# EAGLE design xmegaboard (EAGLE 6.1)
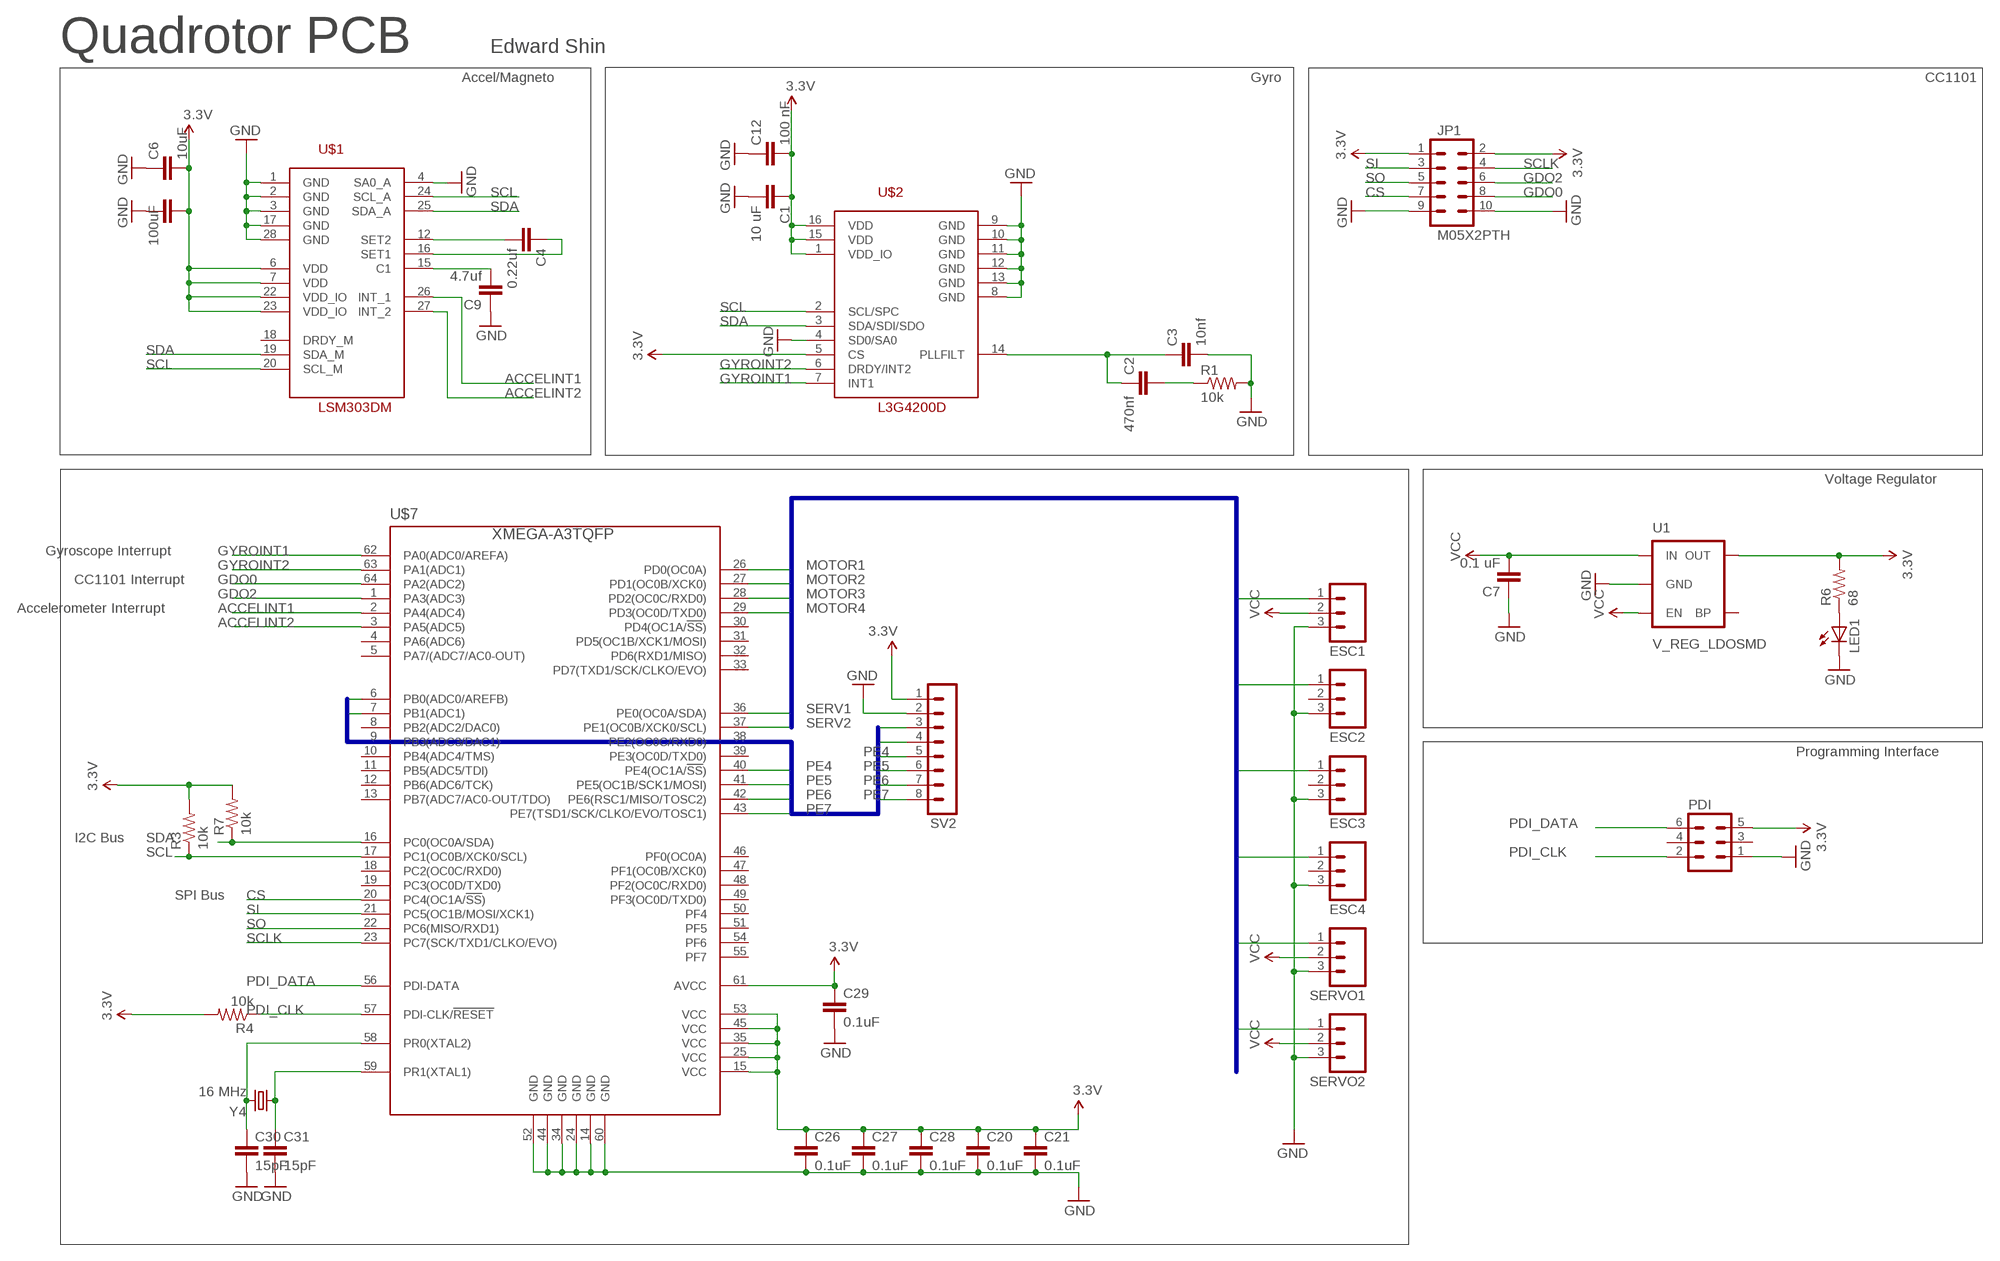
[diagram p0: schematic, sheet 1]

## Parts
C1  10 uF  CAP0603-CAP  [0603-CAP]
C2  470nf  CAP0603-CAP  [0603-CAP]
C3  10nf  CAP0603-CAP  [0603-CAP]
C4  0.22uf  CAP0603-CAP  [0603-CAP]
C5  100uF  CAP0603-CAP  [0603-CAP]
C6  10uF  CAP0603-CAP  [0603-CAP]
C7  0.1 uF  CAP0603-CAP  [0603-CAP]
C9  4.7uf  CAP0603-CAP  [0603-CAP]
C12  100 nF  CAP0603-CAP  [0603-CAP]
C20  0.1uF  CAP0603-CAP  [0603-CAP]
C21  0.1uF  CAP0603-CAP  [0603-CAP]
C26  0.1uF  CAP0603-CAP  [0603-CAP]
C27  0.1uF  CAP0603-CAP  [0603-CAP]
C28  0.1uF  CAP0603-CAP  [0603-CAP]
C29  0.1uF  CAP0603-CAP  [0603-CAP]
C30  15pF  CAP0603-CAP  [0603-CAP]
C31  15pF  CAP0603-CAP  [0603-CAP]
ESC1  M03PTH  [1X03]
ESC2  M03PTH  [1X03]
ESC3  M03PTH  [1X03]
ESC4  M03PTH  [1X03]
JP1  M05X2PTH  [AVR_ICSP]
LED1  LED0603  [LED-0603]
PDI  MA03-2  [MA03-2]
R1  10k  RESISTOR0603-RES  [0603-RES]
R3  10k  RESISTOR0603-RES  [0603-RES]
R4  10k  RESISTOR0603-RES  [0603-RES]
R6  68  RESISTOR0603-RES  [0603-RES]
R7  10k  RESISTOR0603-RES  [0603-RES]
SERVO1  M03PTH  [1X03]
SERVO2  M03PTH  [1X03]
SV2  MA08-1  [MA08-1]
U1  V_REG_LDOSMD  [SOT23-5]
U$1  LSM303DM  [LGA28-5X5]
U$2  L3G4200D  [LGA16-4X4]
U$7  XMEGA-A3TQFP  [TQFP64]
Y4  16 MHz  CRYSTAL32-SMD  [CRYSTAL-32KHZ-SMD]

## Nets
3.3V: C1.1 C5.2 C6.2 C12.2 C20.1 C21.1 C26.1 C27.1 C28.1 C29.1 JP1.1 JP1.2 PDI.5 R3.2 R4.2 R6.2 R7.2 SV2.1 U1.5(OUT) U$1.6(VDD) U$1.7(VDD) U$1.22(VDD_IO) U$1.23(VDD_IO) U$2.1(VDD_IO) U$2.5(CS) U$2.15(VDD) U$2.16(VDD) U$7.15(VCC) U$7.25(VCC) U$7.35(VCC) U$7.45(VCC) U$7.53(VCC) U$7.61(AVCC)
ACCELINT1: U$1.26(INT_1) U$7.2(PA4(ADC4))
ACCELINT2: U$1.27(INT_2) U$7.3(PA5(ADC5))
CS: JP1.7 U$7.20(PC4(OC1A/!SS!))
GDO0: JP1.8 U$7.64(PA2(ADC2))
GDO2: JP1.6 U$7.1(PA3(ADC3))
GND: C1.2 C3.2 C5.1 C6.1 C7.1 C9.1 C12.1 C20.2 C21.2 C26.2 C27.2 C28.2 C29.2 C30.2 C31.2 ESC1.3 ESC2.3 ESC3.3 ESC4.3 JP1.9 JP1.10 LED1.C PDI.1 R1.2 SERVO1.3 SERVO2.3 SV2.2 U1.2(GND) U$1.1(GND) U$1.2(GND) U$1.3(GND) U$1.4(SA0_A) U$1.17(GND) U$1.28(GND) U$2.4(SD0/SA0) U$2.8(GND) U$2.9(GND) U$2.10(GND) U$2.11(GND) U$2.12(GND) U$2.13(GND) U$7.14(GND) U$7.24(GND) U$7.34(GND) U$7.44(GND) U$7.52(GND) U$7.60(GND)
GYROINT1: U$2.7(INT1) U$7.62(PA0(ADC0/AREFA))
GYROINT2: U$2.6(DRDY/INT2) U$7.63(PA1(ADC1))
MOTOR1: ESC1.1 U$7.26(PD0(OC0A))
MOTOR2: ESC2.1 U$7.27(PD1(OC0B/XCK0))
MOTOR3: ESC3.1 U$7.28(PD2(OC0C/RXD0))
MOTOR4: ESC4.1 U$7.29(PD3(OC0D/TXD0))
N$1: C2.1 C3.1 U$2.14(PLLFILT)
N$2: C2.2 R1.1
N$3: C4.2 U$1.12(SET2)
N$4: C4.1 U$1.16(SET1)
N$5: C9.2 U$1.15(C1)
N$11: LED1.A R6.1
N$21: C30.1 U$7.58(PR0(XTAL2)) Y4.X2
N$24: C31.1 U$7.59(PR1(XTAL1)) Y4.X1
PDI_CLK: PDI.2 R4.1 U$7.57(PDI-CLK/!RESET)
PDI_DATA: PDI.6 U$7.56(PDI-DATA)
PE2: SV2.3 U$7.6(PB0(ADC0/AREFB))
PE3: SV2.4 U$7.7(PB1(ADC1))
PE4: SV2.5 U$7.40(PE4(OC1A/!SS!))
PE5: SV2.6 U$7.41(PE5(OC1B/SCK1/MOSI))
PE6: SV2.7 U$7.42(PE6(RSC1/MISO/TOSC2))
PE7: SV2.8 U$7.43(PE7(TSD1/SCK/CLKO/EVO/TOSC1))
SCL: R3.1 U$1.20(SCL_M) U$1.24(SCL_A) U$2.2(SCL/SPC) U$7.17(PC1(OC0B/XCK0/SCL))
SCLK: JP1.4 U$7.23(PC7(SCK/TXD1/CLKO/EVO))
SDA: R7.1 U$1.19(SDA_M) U$1.25(SDA_A) U$2.3(SDA/SDI/SDO) U$7.16(PC0(OC0A/SDA))
SERV1: SERVO1.1 U$7.36(PE0(OC0A/SDA))
SERV2: SERVO2.1 U$7.37(PE1(OC0B/XCK0/SCL))
SI: JP1.3 U$7.21(PC5(OC1B/MOSI/XCK1))
SO: JP1.5 U$7.22(PC6(MISO/RXD1))
VCC: C7.2 ESC1.2 SERVO1.2 SERVO2.2 U1.1(IN) U1.3(EN)
Unconnected: ESC2.2 ESC3.2 ESC4.2 PDI.3 PDI.4 U1.4(BP) U$1.18(DRDY_M) U$7.4(PA6(ADC6)) U$7.5(PA7/(ADC7/AC0-OUT)) U$7.8(PB2(ADC2/DAC0)) U$7.9(PB3(ADC3/DAC1)) U$7.10(PB4(ADC4/TMS)) U$7.11(PB5(ADC5/TDI)) U$7.12(PB6(ADC6/TCK)) U$7.13(PB7(ADC7/AC0-OUT/TDO)) U$7.18(PC2(OC0C/RXD0)) U$7.19(PC3(OC0D/TXD0)) U$7.30(PD4(OC1A/!SS!)) U$7.31(PD5(OC1B/XCK1/MOSI)) U$7.32(PD6(RXD1/MISO)) U$7.33(PD7(TXD1/SCK/CLKO/EVO)) U$7.38(PE2(OC0C/RXD0)) U$7.39(PE3(OC0D/TXD0)) U$7.46(PF0(OC0A)) U$7.47(PF1(OC0B/XCK0)) U$7.48(PF2(OC0C/RXD0)) U$7.49(PF3(OC0D/TXD0)) U$7.50(PF4) U$7.51(PF5) U$7.54(PF6) U$7.55(PF7)

## Buses
MOTOR[1..4],SERV[1..2]
PE[2..7]

## Notes on the sheet
- Quadrotor PCB | Edward Shin
- Accel/Magneto | Gyro | CC1101
- Voltage Regulator
- Gyroscope Interrupt
- CC1101 Interrupt
- Accelerometer Interrupt
- Programming Interface
- I2C Bus
- SPI Bus

## Library data of the parts
C1-C7 C9 C12 C20 C21 C26-C31 = SparkFun:CAP: Capacitor Standard 0603 ceramic capacitor, and 0.1" leaded capacitor.
ESC1-ESC4 SERVO1 SERVO2 = SparkFun:M03: Header 3 Standard 3-pin 0.1" header. Use with straight break away headers (SKU : PRT-00116), right angle break away headers (PRT-00553), swiss pins (PRT-00743), machine pins (PRT-00117), and female headers (PRT-00115). Molex polarized connector foot print use with SKU : PRT-08232 with associated crimp pins and housings.
JP1 = SparkFun:M05X2: Header 5x2 Standard 10-pin dual row 0.1" header. Commonly used with AVR-ISP. Use with Spark Fun Electronics SKU: PRT-00778
LED1 = SparkFun:LED: LEDs Standard schematic elements and footprints for 5mm, 3mm, 1206, and 0603 sized LEDs. 5mm - Spark Fun Electronics SKU : COM-00529 (and others)
PDI = con-lstb:MA03-2: PIN HEADER; OC_FARNELL: unknown; OC_NEWARK: unknown
R1 R3 R4 R6 R7 = SparkFun:RESISTOR: Resistor Basic schematic elements and footprints for 0603, 1206, and PTH resistors.
SV2 = con-lstb:MA08-1: PIN HEADER; OC_FARNELL: unknown; OC_NEWARK: unknown
U1 = SparkFun:V_REG_LDO: Voltage Regulator LDO Standard 150mA LDO voltage regulator in SOT-23 layout. Micrel part MIC5205. BP (by-pass) pin is used to lower output noise with 470pF cap.
U$1 = st-microelectronics:LSM303DM
U$2 = st-microelectronics:L3G4200D
U$7 = avr-7:XMEGA-A3: Atmel XMega A3 series processor
Y4 = SparkFun:CRYSTAL: Crystals Various standard crystals. Proven footprints. Spark Fun Electronics SKU : COM-00534

## Board
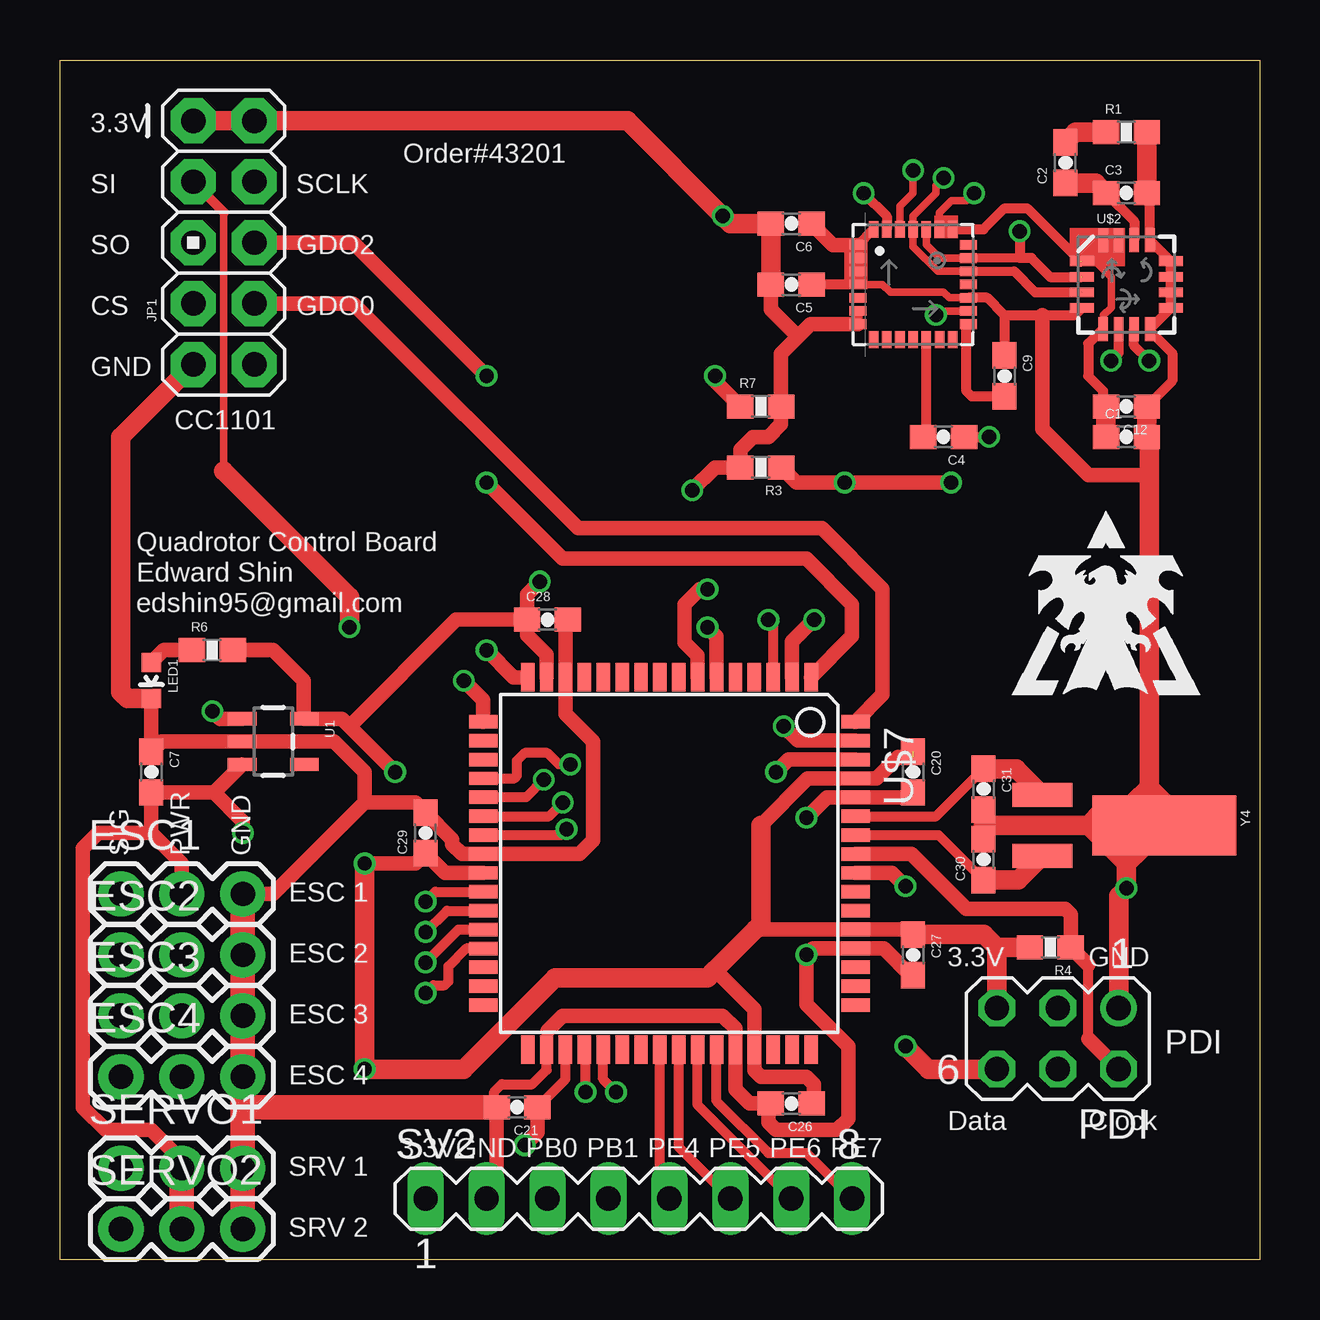
[diagram p1: board, top side]
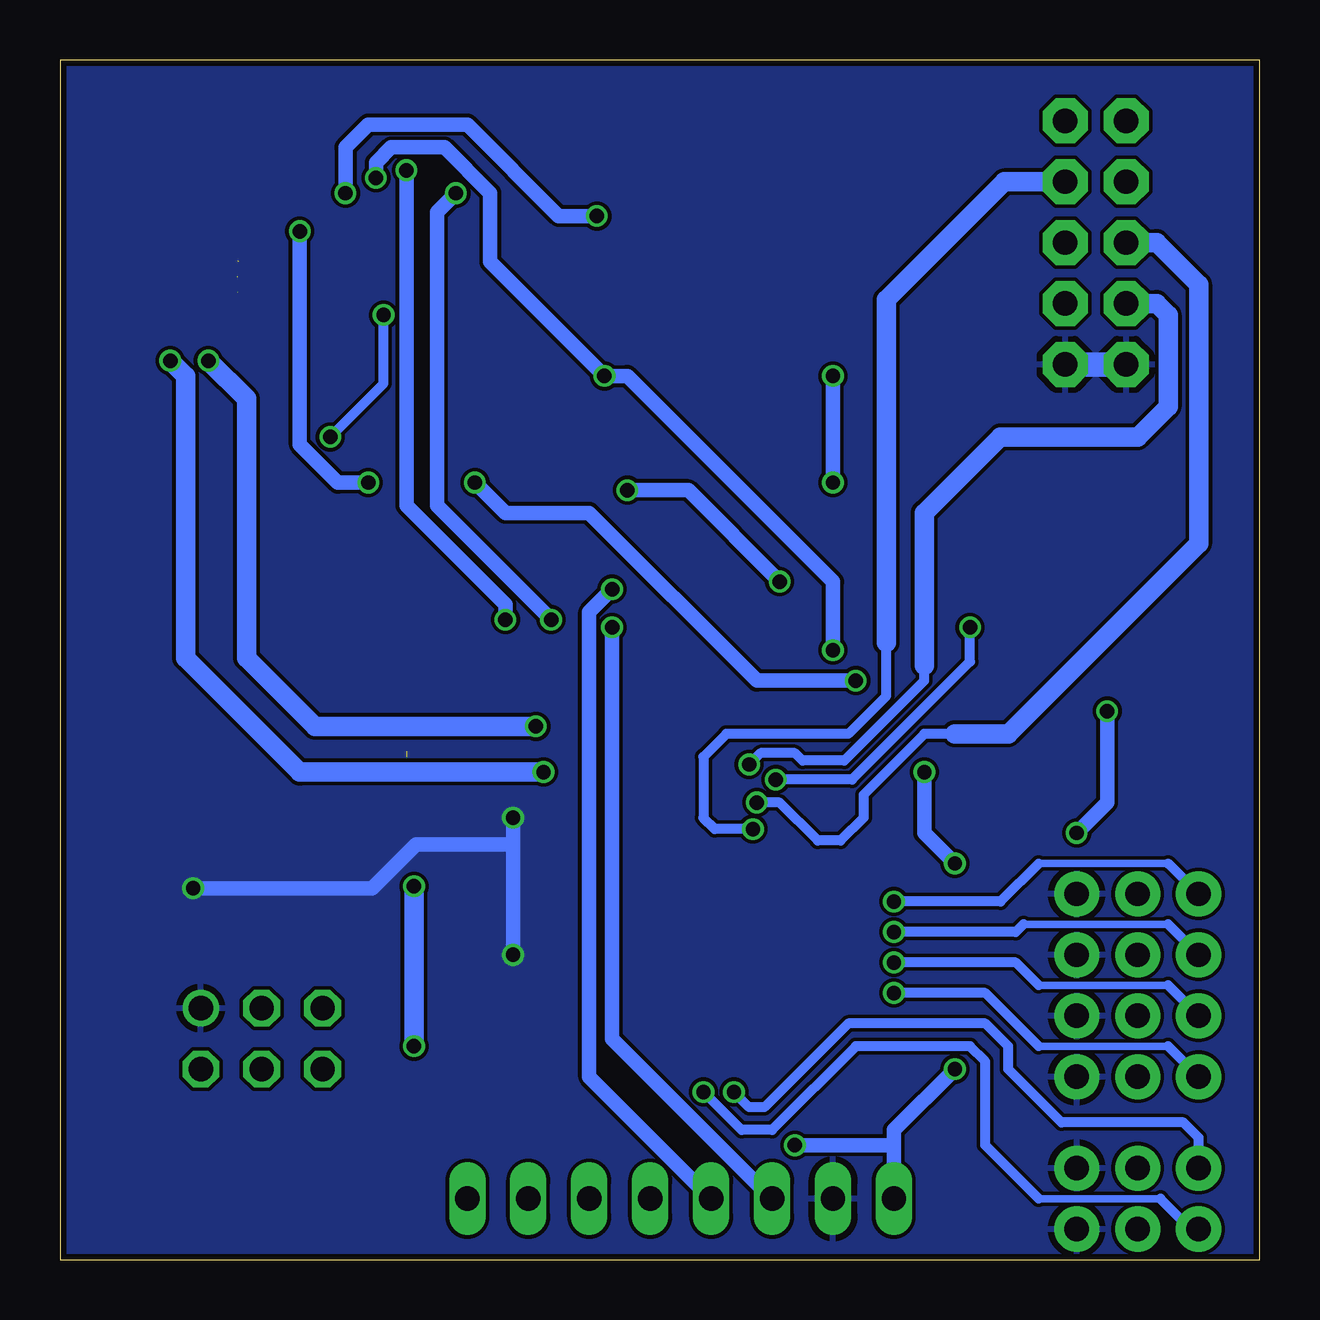
[diagram p2: board, bottom side, seen from below]

Size 50 x 50 mm. Coordinates in mm from the lower left corner, seen from the top.
Outline: 0,0 0,50 50,50 50,0 0,0
Copper layers (1*16): Top 0.035mm / dielectric 1.5mm / Bottom 0.035mm
Design rules: minimum track width 6mil, minimum drill 12mil, track to track 6mil, track to pad 6mil, pad to pad 6mil, via to via 6mil, smd to smd 0mil, copper to edge 10mil, drill to drill 10mil, minimum pad ring 10mil, minimum via ring 6mil, stop-mask expansion 2mil, vias tented up to drill 100mil, thermal gap 10mil

### Footprints (pad centres in the part's own frame; a part is rotated, then mirrored left to right if it is on the bottom)
0603-CAP = smd 1.1 x 1: 1 -0.85,0; 2 0.85,0
1X03 = drill 1.016 pad 1.88: 1 0,0; 2 2.54,0; 3 5.08,0
AVR_ICSP = drill 1.016 pad 1.88 octagon: 1 -1.27,5.08; 2 1.27,5.08; 3 -1.27,2.54; 4 1.27,2.54; 5 -1.27,0; 6 1.27,0; 7 -1.27,-2.54; 8 1.27,-2.54; 9 -1.27,-5.08; 10 1.27,-5.08
LED-0603 = smd 0.8 x 0.8: A 0,-0.75; C 0,0.75
MA03-2 = drill 1.016: 1 -2.54,-1.27 | drill 1.016 octagon: 2 -2.54,1.27; 3 0,-1.27; 4 0,1.27; 5 2.54,-1.27; 6 2.54,1.27
0603-RES = smd 1.1 x 1: 1 -0.85,0; 2 0.85,0
MA08-1 = drill 1.016 long: 1 -8.89,0; 2 -6.35,0; 3 -3.81,0; 4 -1.27,0; 5 1.27,0; 6 3.81,0; 7 6.35,0; 8 8.89,0
SOT23-5 = smd 0.55 x 1.2: 1 -0.95,-1.3; 2 0,-1.3; 3 0.95,-1.3; 4 0.95,1.3; 5 -0.95,1.3
LGA28-5X5 = smd 0.7 x 0.4: 1 -2.3,1.65; 2 -2.3,1.1; 3 -2.3,0.55; 4 -2.3,0; 5 -2.3,-0.55; 6 -2.3,-1.1; 7 -2.3,-1.65; 15 2.3,-1.65; 16 2.3,-1.1; 17 2.3,-0.55; 18 2.3,0; 19 2.3,0.55; 20 2.3,1.1; 21 2.3,1.65 | smd 0.4 x 0.7: 8 -1.65,-2.3; 9 -1.1,-2.3; 10 -0.55,-2.3; 11 0,-2.3; 12 0.55,-2.3; 13 1.1,-2.3; 14 1.65,-2.3; 22 1.65,2.3; 23 1.1,2.3; 24 0.55,2.3; 25 0,2.3; 26 -0.55,2.3; 27 -1.1,2.3; 28 -1.65,2.3
LGA16-4X4 = smd 1 x 0.4: 1 -1.85,0.975; 2 -1.85,0.325; 3 -1.85,-0.325; 4 -1.85,-0.975; 9 1.85,-0.975; 10 1.85,-0.325; 11 1.85,0.325; 12 1.85,0.975 | smd 0.4 x 1: 5 -0.975,-1.85; 6 -0.325,-1.85; 7 0.325,-1.85; 8 0.975,-1.85; 13 0.975,1.85; 14 0.325,1.85; 15 -0.325,1.85; 16 -0.975,1.85
TQFP64 = smd 1.194 x 0.559: 1 -7.76,5.905; 2 -7.76,5.118; 3 -7.76,4.331; 4 -7.76,3.543; 5 -7.76,2.756; 6 -7.76,1.968; 7 -7.76,1.181; 8 -7.76,0.394; 9 -7.76,-0.394; 10 -7.76,-1.181; 11 -7.76,-1.968; 12 -7.76,-2.756; 13 -7.76,-3.543; 14 -7.76,-4.331; 15 -7.76,-5.118; 16 -7.76,-5.905; 33 7.76,-5.905; 34 7.76,-5.118; 35 7.76,-4.331; 36 7.76,-3.543; 37 7.76,-2.756; 38 7.76,-1.968; 39 7.76,-1.181; 40 7.76,-0.394; 41 7.76,0.394; 42 7.76,1.181; 43 7.76,1.968; 44 7.76,2.756; 45 7.76,3.543; 46 7.76,4.331; 47 7.76,5.118; 48 7.76,5.905 | smd 0.559 x 1.194: 17 -5.905,-7.76; 18 -5.118,-7.76; 19 -4.331,-7.76; 20 -3.543,-7.76; 21 -2.756,-7.76; 22 -1.968,-7.76; 23 -1.181,-7.76; 24 -0.394,-7.76; 25 0.394,-7.76; 26 1.181,-7.76; 27 1.968,-7.76; 28 2.756,-7.76; 29 3.543,-7.76; 30 4.331,-7.76; 31 5.118,-7.76; 32 5.905,-7.76; 49 5.905,7.76; 50 5.118,7.76; 51 4.331,7.76; 52 3.543,7.76; 53 2.756,7.76; 54 1.968,7.76; 55 1.181,7.76; 56 0.394,7.76; 57 -0.394,7.76; 58 -1.181,7.76; 59 -1.968,7.76; 60 -2.756,7.76; 61 -3.543,7.76; 62 -4.331,7.76; 63 -5.118,7.76; 64 -5.905,7.76
CRYSTAL-32KHZ-SMD = smd 2.5 x 6: SHEILD 0,5.08 | smd 1 x 2.5: X1 -1.27,0; X2 1.27,0

### Placement (x,y rotation side)
C1  44.45,34.29 0 top
C2  41.91,45.72 90 top
C3  44.45,44.45 0 top
C4  36.83,34.29 180 top
C5  30.48,40.64 180 top
C6  30.48,43.18 180 top
C7  3.81,20.32 270 top
C9  39.37,36.83 270 top
C12  44.45,35.56 180 top
C20  35.56,20.32 270 top
C21  19.05,6.35 180 top
C26  30.48,6.51 180 top
C27  35.56,12.7 270 top
C28  20.32,26.67 0 top
C29  15.24,17.78 90 top
C30  38.5,16.67 90 top
C31  38.5,19.61 270 top
ESC1  2.54,15.24 0 top
ESC2  2.54,12.7 0 top
ESC3  2.54,10.16 0 top
ESC4  2.54,7.62 0 top
JP1  6.83,42.39 0 top
LED1  3.81,24.13 180 top
PDI  41.59,9.21 180 top
R1  44.45,46.99 0 top
R3  29.21,33.02 180 top
R4  41.28,13.02 180 top
R6  6.35,25.4 0 top
R7  29.21,35.56 0 top
SERVO1  2.54,3.81 0 top
SERVO2  2.54,1.27 0 top
SV2  24.13,2.54 0 top
U1  8.89,21.59 270 top
U$1  35.56,40.64 0 top
U$2  44.45,40.64 0 top
U$7  25.4,16.51 270 top
Y4  40.96,18.1 270 top

### Tracks (layer width: path | path; a pad name or v marks a point on that pad's centre or on a via)
3.3V  (via drill 0.6)  (2 unrouted)
  Top 0.305: U$2.1 43.16,41.62 43.82,40.96 43.82,39.69 43.5,39.37 43.5,38.81 U$2.5 | U$1.23 36.66,43.65 37.15,44.13 37.78,44.13 v38.1,44.45
  Top 0.406: U$7.35 21.07,7.52 C21.1 | 35.36,13.75 C27.1 | 28.99,13.75 29.21,13.97 | C12.2 43.47,35.69 43.47,36.22 42.86,36.83 42.86,38.18 U$2.5 | U$2.1 U$2.16 U$2.15 | U$1.23 U$1.22 38.5,42.94 39.37,43.82 40.32,43.82 42.54,41.59 | U$1.7 U$1.6
  Top 0.61: R6.2 8.89,25.4 10.16,24.13 10.16,22.57 U1.5 11.75,22.54 12.07,22.23 | v13.97,20.32 12.07,22.23 | v12.7,16.51 14.82,16.51 C29.1 16.05,16.12 U$7.25 | C21.1 19.9,5.3 v19.37,4.76 | 35.36,13.75 U$7.53 28.99,13.75 | 29.21,18.1 31.17,20.05 U$7.61 34.02,20.05 34.93,20.96 35.56,20.96 | U$1.7 31.28,38.99 30.75,38.46 | R7.2 30.06,37.77 30.75,38.46 | C28.1 16.51,26.67 12.07,22.23 | C28.1 19.47,26.04 20.28,25.22 U$7.15 | v26.35,32.07 27.31,33.02 R3.2 28.36,33.76 28.89,34.29 29.53,34.29 30.06,34.82 R7.2 | v20,28.26 19.47,27.73 C28.1 | 30.06,35.46 R7.2 | 27.31,12.07 28.94,10.43 U$7.45 28.94,7.89 29.21,7.62 31.11,7.62 31.43,7.3 31.43,6.77 C26.1 | C5.2 29.63,39.59 30.75,38.46
  Top 0.813: v12.7,16.51 v12.7,7.94 16.83,7.94 20.64,11.75 26.99,11.75 27.31,12.07 28.99,13.75 | 29.21,13.97 29.21,18.1 | C5.2 C6.2 27.94,43.18 v27.62,43.5 23.65,47.47 JP1.2 JP1.1 | C12.2 C1.1 | C27.1 38.52,13.55 39.05,13.02 | 39.05,13.02 PDI.5 | R4.2 39.05,13.02
  Bottom 0.61: v13.97,20.32 13.97,17.78 v12.7,16.51 | 15.24,4.76 15.24,5.4 v12.7,7.94 | 15.24,4.76 v19.37,4.76 | SV2.1 15.24,4.76 | v20,28.26 23.81,32.07 v26.35,32.07 | v27.62,43.5 29.21,43.5 33.02,47.31 37.15,47.31 38.1,46.36 v38.1,44.45
ACCELINT1  (via drill 0.6)
  Top 0.305: U$1.26 35.01,43.9 35.56,44.45 v35.56,45.4
  Top 0.61: U$7.2 30.52,25.76 v31.43,26.67
  Bottom 0.61: v35.56,45.4 35.56,31.43 31.43,27.31 v31.43,26.67
ACCELINT2  (via drill 0.6)
  Top 0.406: U$7.3 29.73,26.47 v29.53,26.67 | U$1.27 34.46,43.49 v33.5,44.45
  Bottom 0.61: v29.53,26.67 34.29,31.43 34.29,43.66 v33.5,44.45
CS  (via drill 0.6)
  Top 0.406: v21.27,20.64 20.8,20.64 20.32,21.11 19.37,21.11 19.05,20.8 19.05,20.16 18.94,20.05 U$7.20
  Bottom 0.406: v21.27,20.64 20.8,21.11 19.37,21.11 19.05,20.8 17.3,20.8 13.97,24.13 13.97,24.77
  Bottom 0.813: JP1.7 4.29,39.85 3.81,39.37 3.81,35.56 5.08,34.29 10.8,34.29 13.97,31.12 13.97,24.77
GDO0
  Top 0.61: U$7.64 34.29,23.55 34.29,27.94 31.75,30.48 21.59,30.48 12.22,39.85 JP1.8
GDO2  (via drill 0.6)
  Top 0.61: U$7.1 33.02,25.98 33.02,27.31 31.11,29.21 20.96,29.21 v17.78,32.39 | JP1.6 12.22,42.39 v17.78,36.83
  Bottom 0.61: v17.78,32.39 v17.78,36.83
GND  (via drill 0.6)
  Top 0.254: U$1.3 U$1.2 U$1.1
  Top 0.305: U$1.17 37.06,40.09 36.83,40.32 34.61,40.32 34.29,40.64 U$1.4 U$1.3 | 21.07,26.57 C28.2
  Top 0.406: 35.56,19.27 C20.2 | C21.2 18.1,6.45 18.1,6.99 18.42,7.3 19.68,7.3 20.28,7.9 U$7.34 20.32,8.79 20.32,9.53 | 45.4,35.56 C12.1 46.36,36.62 46.36,37.78 45.43,38.71 U$2.8 U$2.9 U$2.10 U$2.11 U$2.12 U$2.13 45.43,44.33 C3.2 | U$1.17 38.65,40.09 39.37,39.37 | 39.37,39.37 C9.1 | U$1.1 U$1.28 | U$1.4 C5.1 | 39.37,39.37 40.96,39.37 42.31,39.37 U$2.4
  Top 0.61: LED1.C C7.1 4.23,21.59 U1.2 11.43,21.59 12.7,20.32 12.7,19.05 | ESC1.3 8.89,15.24 12.7,19.05 | 12.7,19.05 14.82,19.05 C29.2 16.35,17.52 16.35,17.3 16.75,16.9 U$7.24 21.67,16.9 22.22,17.46 22.22,21.59 21.07,22.75 U$7.14 21.07,26.57 | ESC4.3 7.62,6.51 | 35.56,19.27 U$7.60 31.97,19.27 v31.11,18.42 | C21.2 18.2,2.96 SV2.2 | 45.4,32.7 42.86,32.7 40.96,34.61 40.96,39.37 | U$1.1 32.22,42.29 C6.1 | 35.56,12.07 C27.2 35.56,11.75 34.34,12.97 U$7.52 31.38,12.97 v31.11,12.7 31.11,10.64 32.86,8.89 32.86,5.87 32.39,5.4 29.85,5.4 29.53,5.72 29.53,6.41 C26.2 | 20.32,9.53 20.96,10.16 27.62,10.16 28.16,9.63 U$7.44 28.16,7.09 28.73,6.51 C26.2 | 29.53,6.57 C26.2
  Top 0.813: C3.2 R1.2 | C31.2 C30.2 38.5,18.02 38.58,18.1 42.86,18.1 | 45.4,19.69 45.4,18.73 45.24,18.73 44.45,17.94 | 45.4,19.69 45.4,32.7 45.4,34.19 C1.2 C12.1 | 44.45,16.51 v44.45,15.48 44.13,15.16 PDI.1 | 44.45,16.51 44.45,17.94 | 42.86,18.1 44.29,18.1 44.45,17.94 | JP1.9 2.54,34.29 2.54,23.65 2.81,23.38 LED1.C | 44.77,19.05 45.4,19.69 | 45.4,19.69 46.04,19.05 | 44.45,16.51 45.08,17.15 | 44.45,16.51 43.82,17.15 | 43.5,17.46 42.86,18.1 | 43.5,18.73 42.86,18.1
  Top 1.016: C21.2 7.78,6.35 7.62,6.51 | SERVO2.3 SERVO1.3 ESC4.3 ESC3.3 ESC2.3 ESC1.3
  Bottom 0.406: 31.11,17.22 31.19,17.3
  Bottom 0.61: v31.11,12.7 31.11,17.22 v31.11,18.42 | v44.45,15.48 36.99,15.48 35.16,17.3 31.19,17.3
  Bottom 1.016: JP1.10 JP1.9
  pour Bottom (isolate 0.001): -2.78,-4.6 51.67,-4.6 51.67,-5 51.75,-5 51.75,51.59 -2.78,51.59
GYROINT1  (via drill 0.6)
  Top 0.406: v45.4,37.47 44.77,38.1 U$2.7
  Top 0.61: U$7.62 30.37,20.84 v29.85,20.32
  Bottom 0.813: v29.85,20.32 40,20.32 44.77,25.08 44.77,36.83 v45.4,37.47
GYROINT2  (via drill 0.6)
  Top 0.406: v43.82,37.47 44.13,37.78 U$2.6
  Top 0.61: U$7.63 30.76,21.63 v30.16,22.23
  Bottom 0.813: v30.16,22.23 39.37,22.23 42.23,25.08 42.23,35.88 v43.82,37.47
MOTOR1  (via drill 0.6)
  Top 0.406: U$7.26 15.65,15.33 v15.24,14.92
  Bottom 0.305: 3.81,16.51 9.21,16.51
  Bottom 0.406: v15.24,14.92 10.8,14.92 9.21,16.51 | ESC1.1 3.81,16.51
MOTOR2  (via drill 0.6)
  Top 0.406: U$7.27 16.13,14.54 v15.24,13.65
  Bottom 0.305: 3.81,13.97 9.84,13.97
  Bottom 0.406: v15.24,13.65 10.16,13.65 9.84,13.97 | ESC2.1 3.81,13.97
MOTOR3  (via drill 0.6)
  Top 0.406: U$7.28 16.61,13.75 v15.24,12.38
  Bottom 0.305: 3.81,11.43 9.21,11.43
  Bottom 0.406: v15.24,12.38 10.16,12.38 9.21,11.43 | ESC3.1 3.81,11.43
MOTOR4  (via drill 0.6)
  Top 0.406: v15.24,11.11 15.56,11.43 16.03,11.43 16.19,11.59 16.19,12.22 16.94,12.97 U$7.29
  Bottom 0.305: 3.81,8.89 9.21,8.89
  Bottom 0.406: v15.24,11.11 11.43,11.11 9.21,8.89 | ESC4.1 3.81,8.89
N$1
  Top 0.406: U$2.14 44.78,43.28 C3.1
  Top 0.813: C2.1 43.18,44.87 C3.1
N$2
  Top 0.813: R1.1 42.33,46.99 C2.2
N$3
  Top 0.406: U$1.12 36.11,34.42 C4.2
N$4  (via drill 0.6)
  Top 0.305: U$1.16 36.68,39.54 v36.51,39.37
  Top 0.406: C4.1 v38.74,34.29
  Bottom 0.406: v36.51,39.37 36.51,36.51 v38.74,34.29
N$5
  Top 0.305: 37.78,38.91 U$1.15
  Top 0.406: C9.2 38,35.98 37.78,36.2 37.78,38.91
N$11
  Top 0.61: R6.1 4.33,25.4 LED1.A
N$21
  Top 0.406: U$7.58 36.62,17.69 C30.1
  Top 0.813: Y4.X2 39.95,15.82 C30.1
N$24
  Top 0.406: U$7.59 36.52,18.48 C31.1
  Top 0.813: C31.1 39.87,20.46 Y4.X1
PDI_CLK
  Top 0.406: 42.86,9.21 42.86,12.28
  Top 0.61: PDI.2 42.86,9.21 | 42.86,12.28 R4.1 42.13,14.39 41.91,14.61 37.78,14.61 35.48,16.9 U$7.57
PDI_DATA  (via drill 0.6)
  Top 0.61: U$7.56 34.68,16.12 v35.24,15.56
  Top 0.813: PDI.6 36.19,7.94 v35.24,8.89
  Bottom 0.813: v35.24,8.89 v35.24,15.56
PE2  (via drill 0.6)
  Top 0.61: U$7.6 27.37,25.97 v26.99,26.35
  Bottom 0.61: v26.99,26.35 26.99,9.21 SV2.3
PE3  (via drill 0.6)
  Top 0.61: v26.99,27.94 26.67,27.94 26.04,27.31 26.04,25.72 26.58,25.17 U$7.7
  Bottom 0.61: SV2.4 27.94,7.62 27.94,26.99 v26.99,27.94
PE4
  Top 0.406: U$7.40 25.01,2.93 SV2.5
PE5
  Top 0.406: U$7.41 25.79,4.69 SV2.6
PE6
  Top 0.406: U$7.42 26.58,6.44 SV2.7
PE7
  Top 0.406: U$7.43 27.37,6.6 29.53,4.45 31.11,4.45 SV2.8
SCL  (via drill 0.6)  (1 unrouted)
  Top 0.305: 39.2,41.74 U$1.20 36.68,41.74 36.11,42.31 U$1.24
  Top 0.381: 40,41.74 U$1.20
  Top 0.406: U$2.2 41.28,40.96 40.49,41.74 40,41.74 v40,42.86
  Top 0.61: U$7.17 17.64,23.32 v16.83,24.13 | R3.1 30.69,32.39 v32.7,32.39 v37.15,32.39
  Bottom 0.61: v40,42.86 40,33.97 38.42,32.39 v37.15,32.39 | v16.83,24.13 20.96,24.13 27.94,31.12 31.43,31.12 v32.7,32.39
SCLK  (via drill 0.6)
  Top 0.406: U$7.23 20.87,17.69 v21.11,17.94
  Bottom 0.406: 15.56,25.72 15.56,23.5 17.14,21.91 22.22,21.91 23.18,20.96 23.18,18.42 22.7,17.94 v21.11,17.94
  Bottom 0.813: 15.56,25.72 15.56,40.01 10.64,44.93 JP1.4
SDA  (via drill 0.6)  (1 unrouted)
  Top 0.305: U$1.19 36.6,41.19 35.56,42.23 U$1.25 35.56,43.5 36.51,44.45 36.51,44.77 v36.83,45.09
  Top 0.381: U$1.19 39.77,41.19
  Top 0.406: 39.77,41.19 40.64,40.32 U$2.3
  Top 0.61: v27.31,36.83 27.31,36.62 R7.1 | U$7.16 18.91,24.27 v17.78,25.4
  Bottom 0.61: v17.78,25.4 17.78,28.26 26.35,36.83 v27.31,36.83 32.07,41.59 32.07,44.45 33.97,46.36 36.19,46.36 36.83,45.72 v36.83,45.09
SERV1  (via drill 0.6)
  Top 0.406: v21.91,6.99 21.91,8.7 U$7.36
  Bottom 0.406: SERVO1.1 2.54,5.08 3.18,5.72 8.25,5.72 10.48,7.94 10.48,8.89 11.43,9.84 17.14,9.84 20.64,6.35 21.27,6.35 v21.91,6.99
SERV2  (via drill 0.6)
  Top 0.406: U$7.37 22.64,7.52 v23.18,6.99
  Bottom 0.305: 4.13,2.54 9.21,2.54
  Bottom 0.406: SERVO2.1 2.86,1.27 4.13,2.54 | 9.21,2.54 11.43,4.76 11.43,8.26 12.07,8.89 16.83,8.89 20.32,5.4 21.59,5.4 v23.18,6.99
SI  (via drill 0.6)
  Top 0.305: 6.83,43.66 6.83,32.86
  Top 0.406: JP1.3 6.83,43.66 | v20.16,20 19.42,19.27 U$7.21
  Top 0.813: 6.83,32.86 12.07,27.62 v12.07,26.35
  Bottom 0.406: v20.16,20 16.99,20 12.07,24.92 v12.07,26.35
SO  (via drill 0.6)
  Top 0.406: U$7.22 20.38,18.48 v20.96,19.05
  Bottom 0.406: v20.96,19.05 20,19.05 18.42,17.46 17.46,17.46 16.51,18.42 16.51,19.37 13.97,21.91 12.7,21.91
  Bottom 0.813: 12.7,21.91 10.48,21.91 2.54,29.85 2.54,40.64 4.29,42.39 JP1.5
VCC  (via drill 0.6)
  Top 0.61: 6.42,19.47 C7.2 3.81,17.78 | 6.42,19.47 U1.3 | U1.1 6.67,22.54 v6.35,22.86 | v7.62,17.78 7.62,18.27 6.42,19.47 | 3.81,17.78 5.08,16.51 ESC1.2 | SERVO1.2 5.08,4.13 3.81,5.4 1.9,5.4 0.95,6.35 0.95,17.15 1.59,17.78 3.81,17.78
  Top 1.016: SERVO2.2 SERVO1.2
  Bottom 0.61: v6.35,22.86 6.35,19.05 v7.62,17.78
(copper drawn outside any net)
  shapes: Top area x8

### Text on the board
tPlace: Order#43201 | SI | SCLK | SO | GDO2 | CS | GDO0 | CC1101 | Quadrotor Control Board | Edward Shin | edshin95@gmail.com | SIG | PWR | GND | ESC 1 | ESC 2 | 3.3V | GND | ESC 3 | PDI | ESC 4 | Data | Clock | 3.3V | GND | PB0 | PB1 | PE4 | PE5 | PE6 | PE7 | SRV 1 | SRV 2
_tsilk: 3.3V | GND